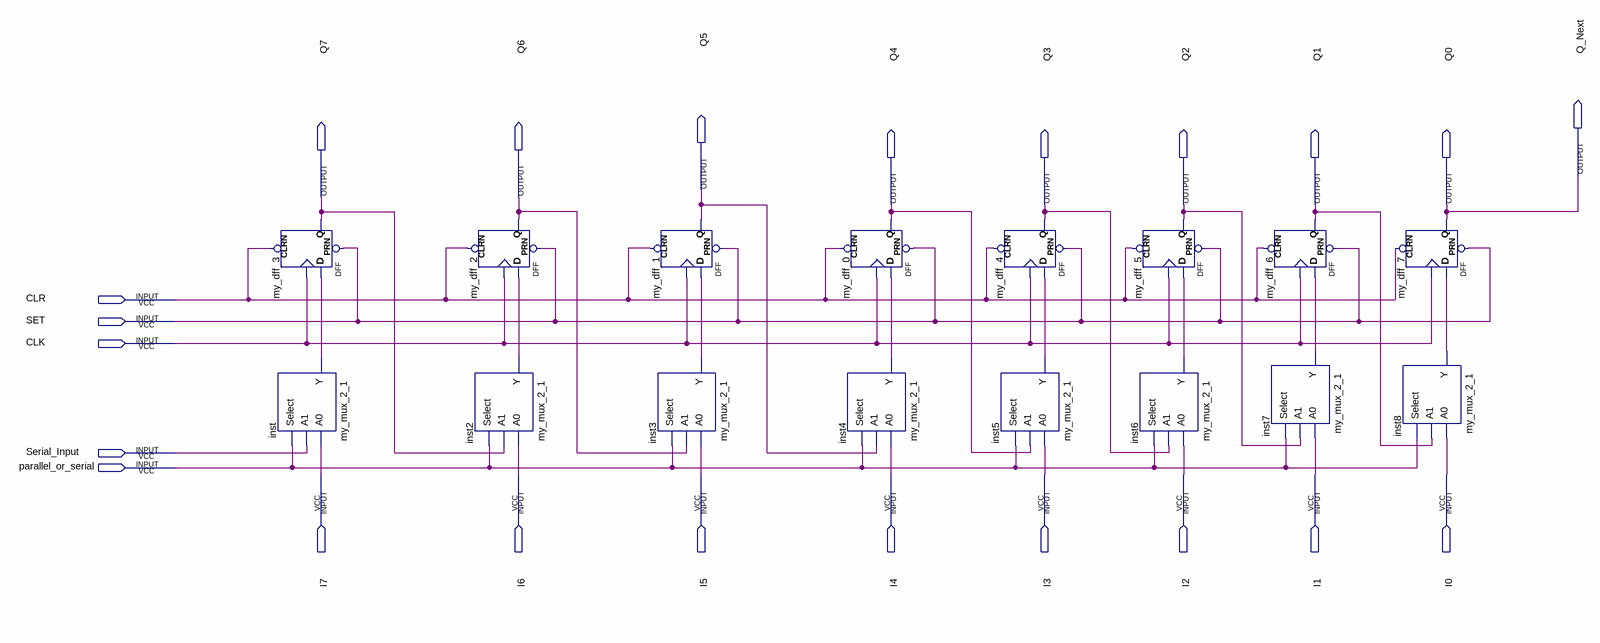
[diagram p0: schematic sheet]
// Quartus schematic my_register.bdf as structural Verilog: 16 symbols, 22 pins
module my_register (
  input  CLR,
  input  SET,
  input  CLK,
  input  Serial_Input,
  input  parallel_or_serial,
  input  I7,
  input  I6,
  input  I5,
  input  I4,
  input  I3,
  input  I2,
  input  I1,
  input  I0,
  output Q_Next,
  output Q5,
  output Q7,
  output Q6,
  output Q4,
  output Q3,
  output Q2,
  output Q1,
  output Q0
);

  wire inst2_y, inst3_y, inst4_y, inst5_y, inst6_y, inst7_y, inst8_y, inst_y;

  my_mux_2_1 inst (.A0(I7), .A1(Serial_Input), .Select(parallel_or_serial), .Y(inst_y));
  DFF my_dff_3 (.CLRN(CLR), .CLK(CLK), .D(inst_y), .PRN(SET), .Q(Q7));
  DFF my_dff_2 (.CLRN(CLR), .CLK(CLK), .D(inst2_y), .PRN(SET), .Q(Q6));
  my_mux_2_1 inst2 (.A0(I6), .A1(Q7), .Select(parallel_or_serial), .Y(inst2_y));
  DFF my_dff_1 (.CLRN(CLR), .CLK(CLK), .D(inst3_y), .PRN(SET), .Q(Q5));
  my_mux_2_1 inst3 (.A0(I5), .A1(Q6), .Select(parallel_or_serial), .Y(inst3_y));
  DFF my_dff_0 (.CLRN(CLR), .CLK(CLK), .D(inst4_y), .PRN(SET), .Q(Q4));
  my_mux_2_1 inst4 (.A0(I4), .A1(Q5), .Select(parallel_or_serial), .Y(inst4_y));
  DFF my_dff_4 (.CLRN(CLR), .CLK(CLK), .D(inst5_y), .PRN(SET), .Q(Q3));
  my_mux_2_1 inst5 (.A0(I3), .A1(Q4), .Select(parallel_or_serial), .Y(inst5_y));
  DFF my_dff_5 (.CLRN(CLR), .CLK(CLK), .D(inst6_y), .PRN(SET), .Q(Q2));
  my_mux_2_1 inst6 (.A0(I2), .A1(Q3), .Select(parallel_or_serial), .Y(inst6_y));
  my_mux_2_1 inst7 (.A0(I1), .A1(Q2), .Select(parallel_or_serial), .Y(inst7_y));
  DFF my_dff_6 (.CLRN(CLR), .CLK(CLK), .D(inst7_y), .PRN(SET), .Q(Q1));
  DFF my_dff_7 (.CLRN(CLR), .CLK(CLK), .D(inst8_y), .PRN(SET), .Q(Q0));
  my_mux_2_1 inst8 (.A0(I0), .A1(Q1), .Select(parallel_or_serial), .Y(inst8_y));

  assign Q_Next = Q0;
endmodule
